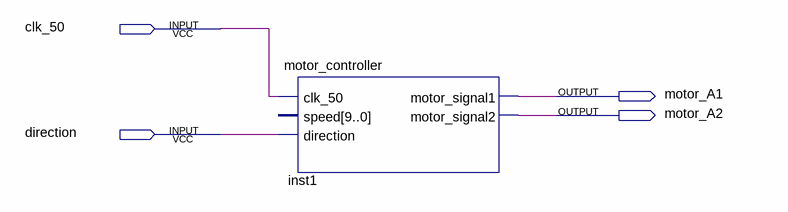
[diagram p0: schematic sheet]
// Quartus schematic MotorControlA1.bdf as structural Verilog: 1 symbols, 4 pins
module MotorControlA1 (
  input  clk_50,
  input  direction,
  output motor_A1,
  output motor_A2
);

  motor_controller inst1 (
    .clk_50(clk_50), .direction(direction), .motor_signal1(motor_A1), .motor_signal2(motor_A2));  // open: speed
endmodule
